# EAGLE schematic 11-16-21_LEDSubMatrixHighDensity_template (EAGLE 9.6.2)
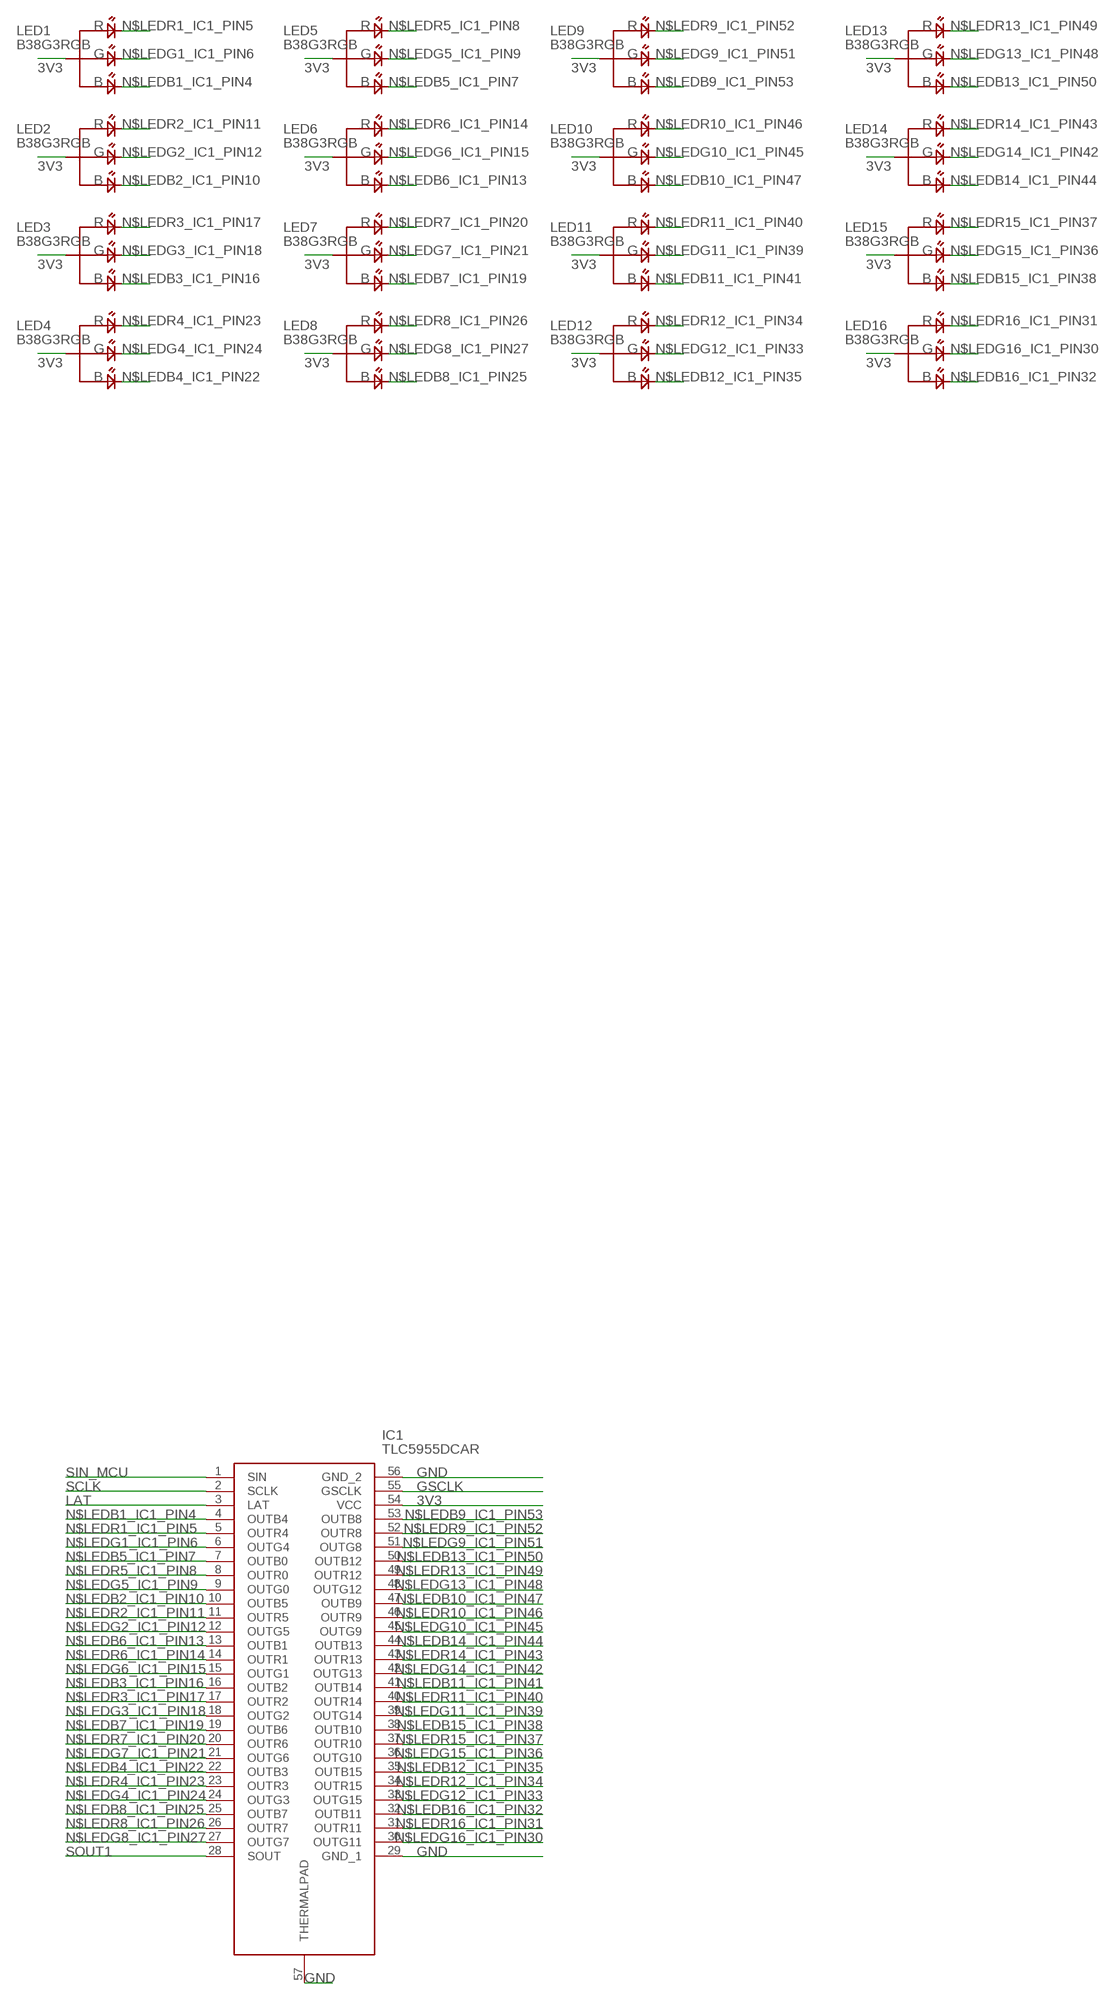
[diagram p0: schematic, sheet 1]

## Parts
IC1  TLC5955DCAR  [SOP50P810X120-57N]
LED1  B38G3RGB  [B38G3RGB]
LED2  B38G3RGB  [B38G3RGB]
LED3  B38G3RGB  [B38G3RGB]
LED4  B38G3RGB  [B38G3RGB]
LED5  B38G3RGB  [B38G3RGB]
LED6  B38G3RGB  [B38G3RGB]
LED7  B38G3RGB  [B38G3RGB]
LED8  B38G3RGB  [B38G3RGB]
LED9  B38G3RGB  [B38G3RGB]
LED10  B38G3RGB  [B38G3RGB]
LED11  B38G3RGB  [B38G3RGB]
LED12  B38G3RGB  [B38G3RGB]
LED13  B38G3RGB  [B38G3RGB]
LED14  B38G3RGB  [B38G3RGB]
LED15  B38G3RGB  [B38G3RGB]
LED16  B38G3RGB  [B38G3RGB]

## Nets
3V3: IC1.54(VCC) LED1.3(COM) LED2.3(COM) LED3.3(COM) LED4.3(COM) LED5.3(COM) LED6.3(COM) LED7.3(COM) LED8.3(COM) LED9.3(COM) LED10.3(COM) LED11.3(COM) LED12.3(COM) LED13.3(COM) LED14.3(COM) LED15.3(COM) LED16.3(COM)
GND: IC1.29(GND_1) IC1.56(GND_2) IC1.57(THERMALPAD)
GSCLK: IC1.55(GSCLK)
LAT: IC1.3(LAT)
N$LEDB1_IC1_PIN4: IC1.4(OUTB4) LED1.2(BLUE)
N$LEDB2_IC1_PIN10: IC1.10(OUTB5) LED2.2(BLUE)
N$LEDB3_IC1_PIN16: IC1.16(OUTB2) LED3.2(BLUE)
N$LEDB4_IC1_PIN22: IC1.22(OUTB3) LED4.2(BLUE)
N$LEDB5_IC1_PIN7: IC1.7(OUTB0) LED5.2(BLUE)
N$LEDB6_IC1_PIN13: IC1.13(OUTB1) LED6.2(BLUE)
N$LEDB7_IC1_PIN19: IC1.19(OUTB6) LED7.2(BLUE)
N$LEDB8_IC1_PIN25: IC1.25(OUTB7) LED8.2(BLUE)
N$LEDB9_IC1_PIN53: IC1.53(OUTB8) LED9.2(BLUE)
N$LEDB10_IC1_PIN47: IC1.47(OUTB9) LED10.2(BLUE)
N$LEDB11_IC1_PIN41: IC1.41(OUTB14) LED11.2(BLUE)
N$LEDB12_IC1_PIN35: IC1.35(OUTB15) LED12.2(BLUE)
N$LEDB13_IC1_PIN50: IC1.50(OUTB12) LED13.2(BLUE)
N$LEDB14_IC1_PIN44: IC1.44(OUTB13) LED14.2(BLUE)
N$LEDB15_IC1_PIN38: IC1.38(OUTB10) LED15.2(BLUE)
N$LEDB16_IC1_PIN32: IC1.32(OUTB11) LED16.2(BLUE)
N$LEDG1_IC1_PIN6: IC1.6(OUTG4) LED1.1(GREEN)
N$LEDG2_IC1_PIN12: IC1.12(OUTG5) LED2.1(GREEN)
N$LEDG3_IC1_PIN18: IC1.18(OUTG2) LED3.1(GREEN)
N$LEDG4_IC1_PIN24: IC1.24(OUTG3) LED4.1(GREEN)
N$LEDG5_IC1_PIN9: IC1.9(OUTG0) LED5.1(GREEN)
N$LEDG6_IC1_PIN15: IC1.15(OUTG1) LED6.1(GREEN)
N$LEDG7_IC1_PIN21: IC1.21(OUTG6) LED7.1(GREEN)
N$LEDG8_IC1_PIN27: IC1.27(OUTG7) LED8.1(GREEN)
N$LEDG9_IC1_PIN51: IC1.51(OUTG8) LED9.1(GREEN)
N$LEDG10_IC1_PIN45: IC1.45(OUTG9) LED10.1(GREEN)
N$LEDG11_IC1_PIN39: IC1.39(OUTG14) LED11.1(GREEN)
N$LEDG12_IC1_PIN33: IC1.33(OUTG15) LED12.1(GREEN)
N$LEDG13_IC1_PIN48: IC1.48(OUTG12) LED13.1(GREEN)
N$LEDG14_IC1_PIN42: IC1.42(OUTG13) LED14.1(GREEN)
N$LEDG15_IC1_PIN36: IC1.36(OUTG10) LED15.1(GREEN)
N$LEDG16_IC1_PIN30: IC1.30(OUTG11) LED16.1(GREEN)
N$LEDR1_IC1_PIN5: IC1.5(OUTR4) LED1.4(RED)
N$LEDR2_IC1_PIN11: IC1.11(OUTR5) LED2.4(RED)
N$LEDR3_IC1_PIN17: IC1.17(OUTR2) LED3.4(RED)
N$LEDR4_IC1_PIN23: IC1.23(OUTR3) LED4.4(RED)
N$LEDR5_IC1_PIN8: IC1.8(OUTR0) LED5.4(RED)
N$LEDR6_IC1_PIN14: IC1.14(OUTR1) LED6.4(RED)
N$LEDR7_IC1_PIN20: IC1.20(OUTR6) LED7.4(RED)
N$LEDR8_IC1_PIN26: IC1.26(OUTR7) LED8.4(RED)
N$LEDR9_IC1_PIN52: IC1.52(OUTR8) LED9.4(RED)
N$LEDR10_IC1_PIN46: IC1.46(OUTR9) LED10.4(RED)
N$LEDR11_IC1_PIN40: IC1.40(OUTR14) LED11.4(RED)
N$LEDR12_IC1_PIN34: IC1.34(OUTR15) LED12.4(RED)
N$LEDR13_IC1_PIN49: IC1.49(OUTR12) LED13.4(RED)
N$LEDR14_IC1_PIN43: IC1.43(OUTR13) LED14.4(RED)
N$LEDR15_IC1_PIN37: IC1.37(OUTR10) LED15.4(RED)
N$LEDR16_IC1_PIN31: IC1.31(OUTR11) LED16.4(RED)
SCLK: IC1.2(SCLK)
SIN_MCU: IC1.1(SIN)
SOUT1: IC1.28(SOUT)

## Library data of the parts
IC1 = TLC5955DCAR:TLC5955DCAR: 48ch, 16bit PWM LED Driver with Dot-Correction, Brightness Control, Open/Short Detection Source: Datasheet <http://www.ti.com/lit/ds/symlink/tlc5955.pdf>; ARROW_PART_NUMBER: TLC5955DCAR; ARROW_PRICE-STOCK: https://www.arrow.com/en/products/tlc5955dcar/texas-instruments; DESCRIPTION: 48ch, 16bit PWM LED Driver with Dot-Correction, Brightness Control, Open/Short Detection; HEIGHT: 1.2mm; MANUFACTURER_NAME: Texas Instruments; MANUFACTURER_PART_NUMBER: TLC5955DCAR; MOUSER_PART_NUMBER: 595-TLC5955DCAR; MOUSER_PRICE-STOCK: https://www.mouser.co.uk/ProductDetail/Texas-Instruments/TLC5955DCAR?qs=%2Fd%252BFzHvH4c3zo%2FeGYG5n7g%3D%3D
LED1-LED16 = B38G3RGB:B38G3RGB: Standard LEDs - SMD Surface Mount LEDs Source: Datasheet <https://www.arrow.com/en/products/sml-lx0606igc-tr/lumex>; ARROW_PART_NUMBER: SML-LX0606IGC-TR; ARROW_PRICE-STOCK: https://www.arrow.com/en/products/sml-lx0606igc-tr/lumex; DESCRIPTION: Standard LEDs - SMD Surface Mount LEDs; HEIGHT: 0.7mm; MANUFACTURER_NAME: Lumex; MANUFACTURER_PART_NUMBER: SML-LX0606IGC-TR; MOUSER_PART_NUMBER: 696-SML-0606IGCTR; MOUSER_PRICE-STOCK: https://www.mouser.co.uk/ProductDetail/Lumex/SML-LX0606IGC-TR?qs=I1ILoAvtKy%252BVd7WFwiUkZQ%3D%3D